# EAGLE design BMS-before routing (EAGLE 6.5.0)
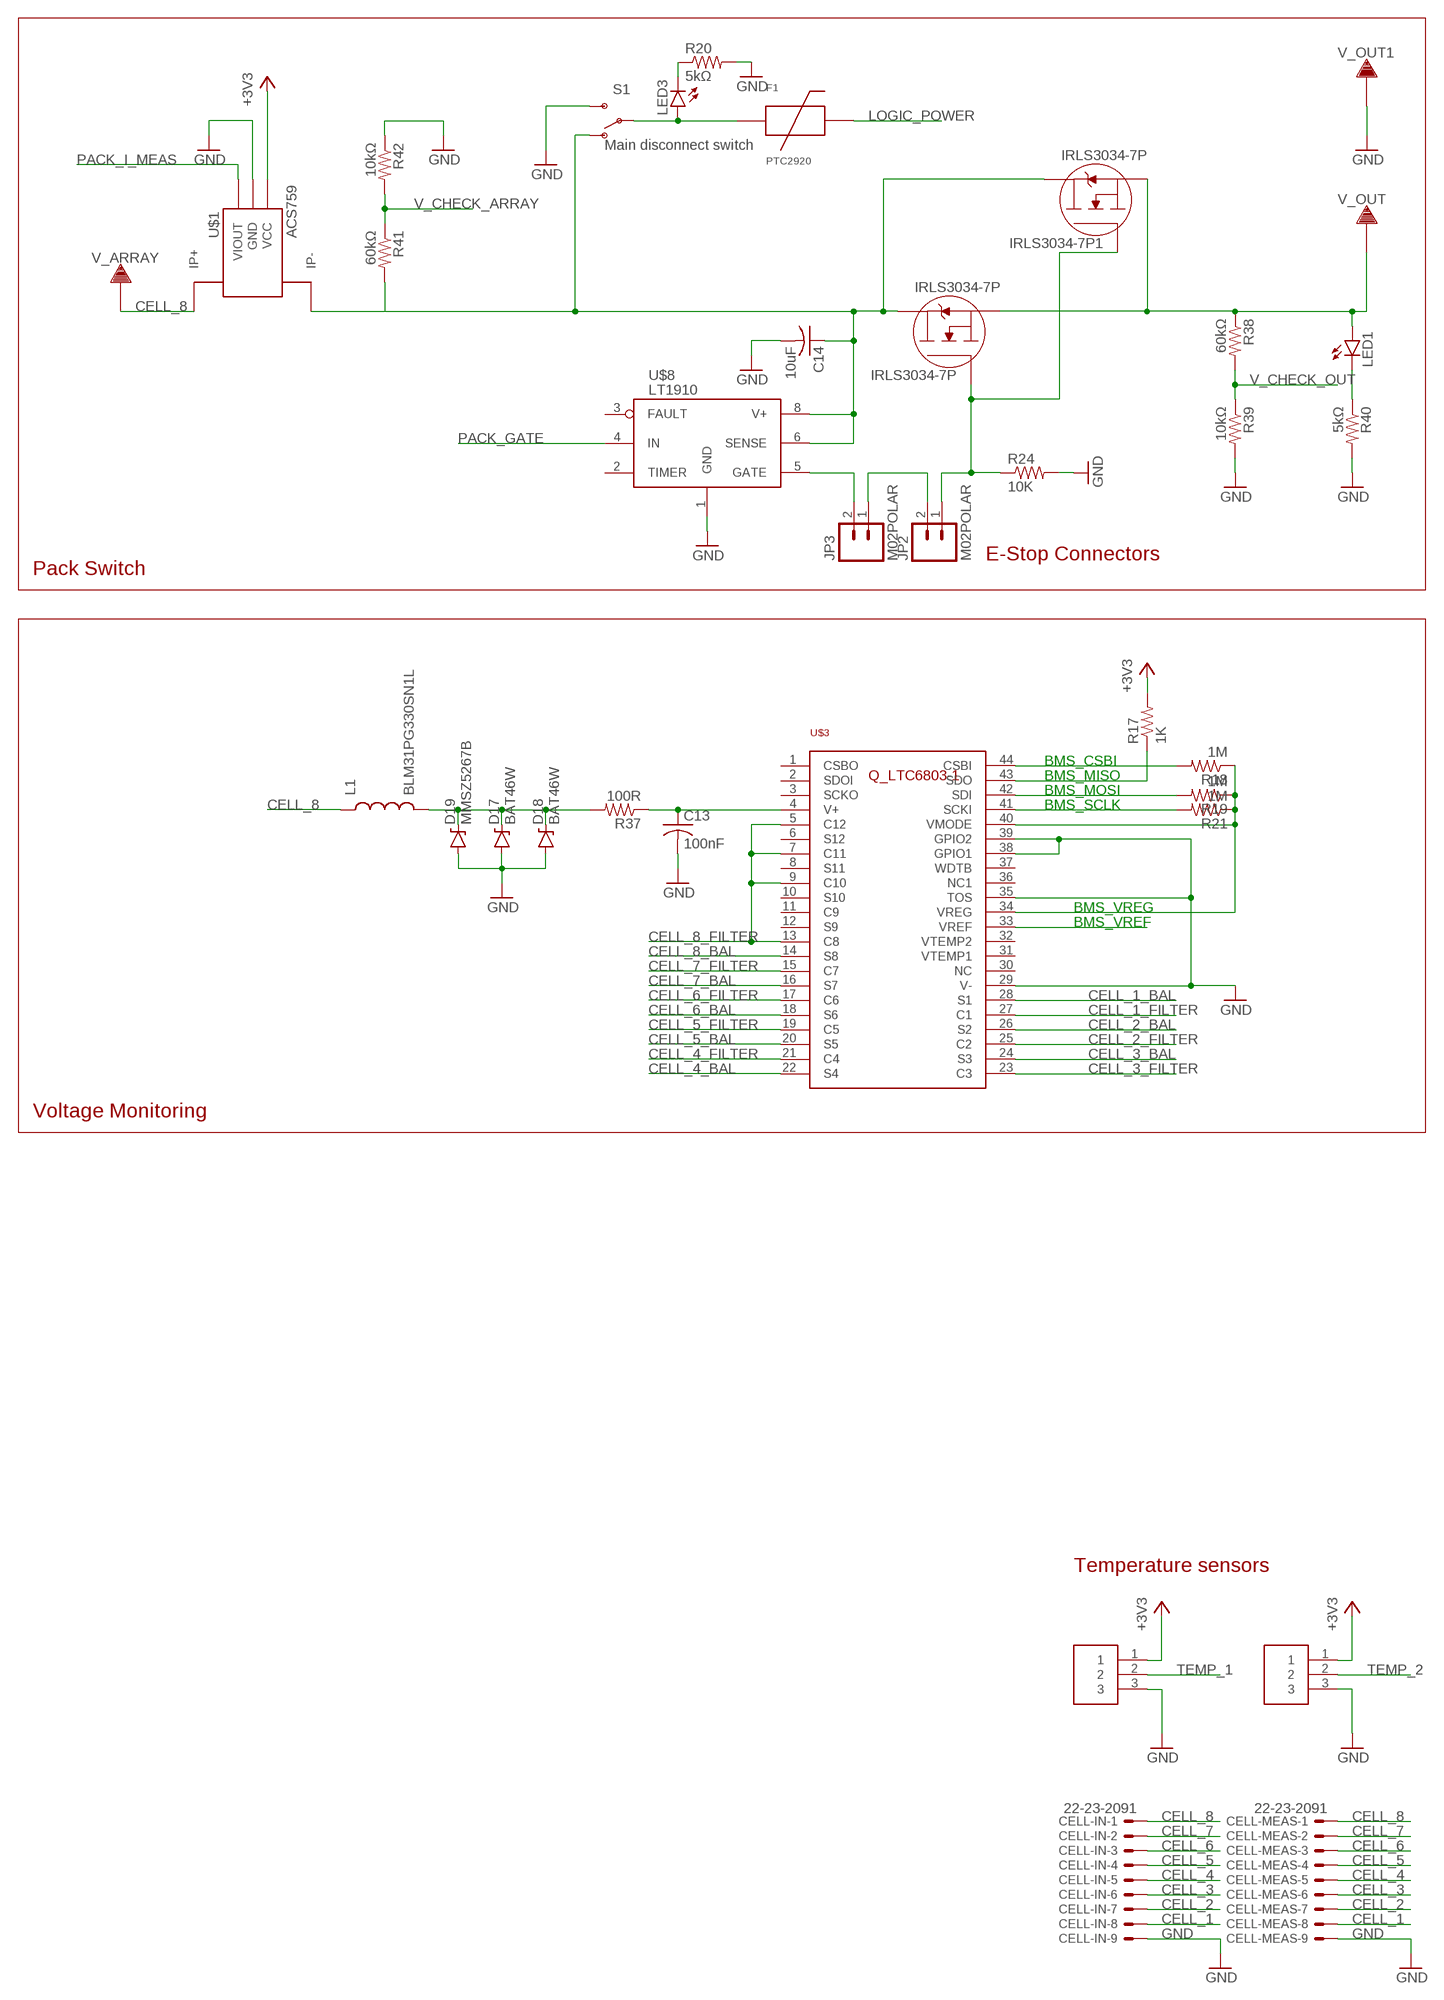
[diagram p0: schematic, sheet 1, part 1 of 2]
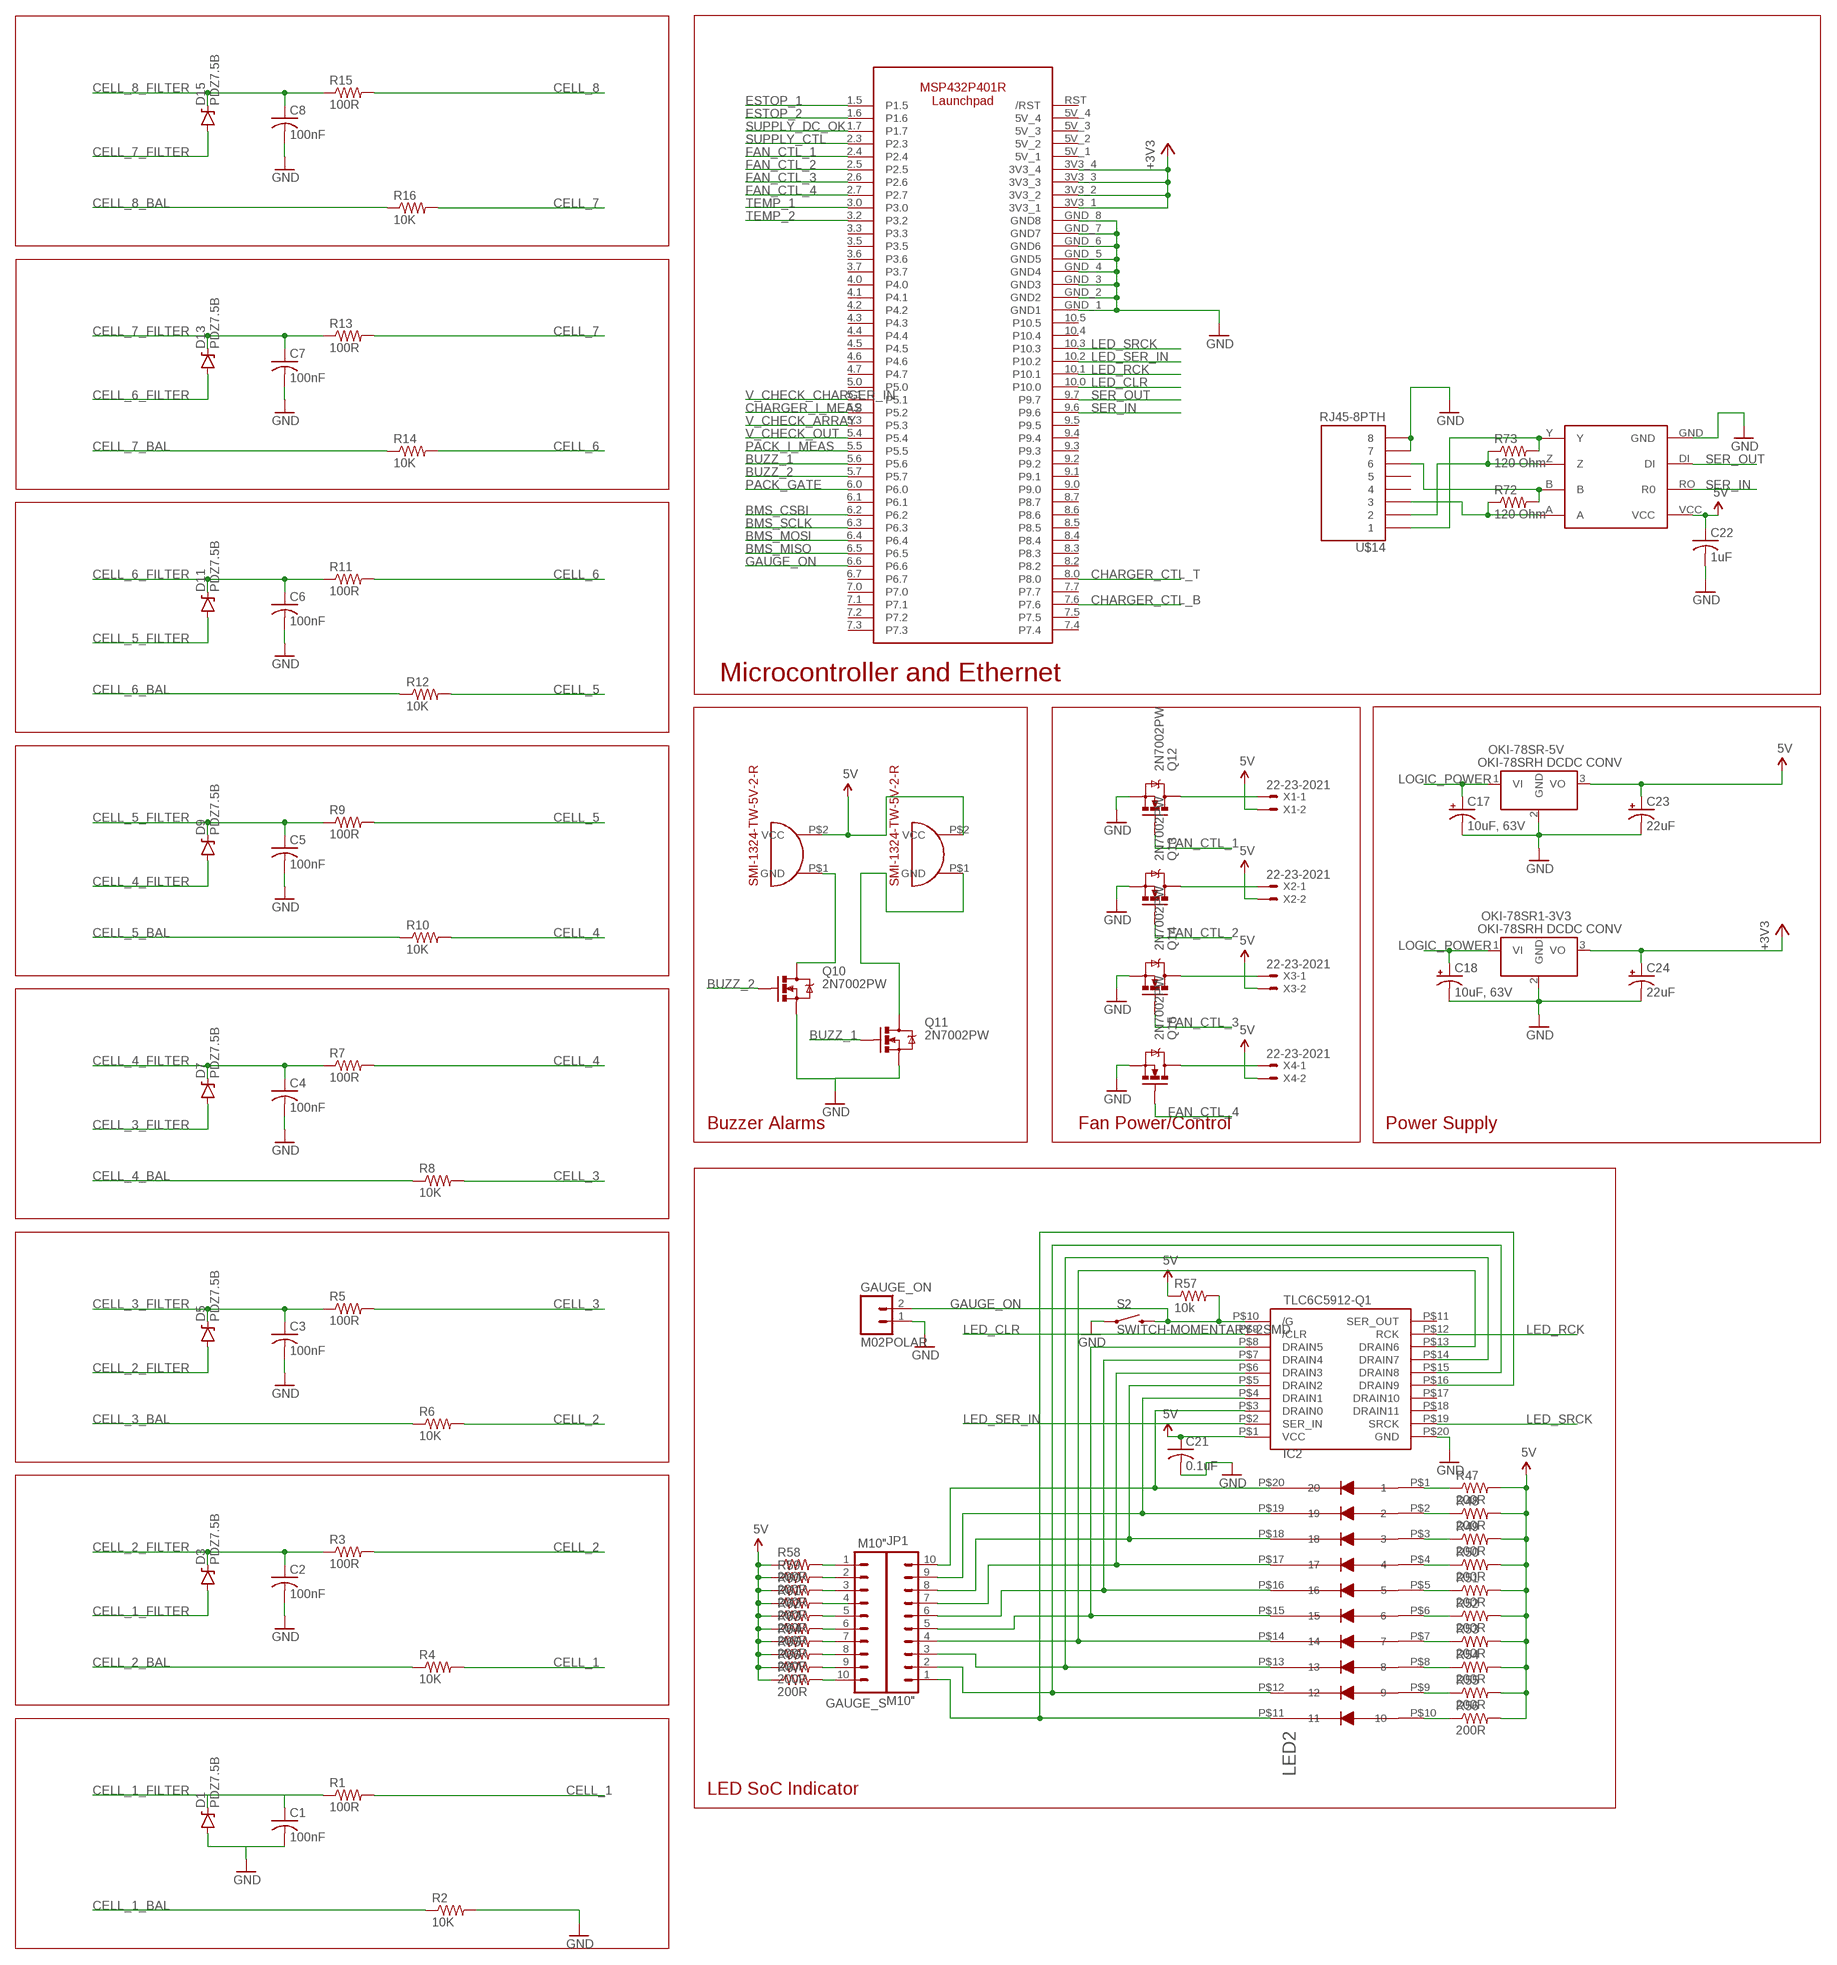
[diagram p1: schematic, sheet 1, part 2 of 2]

## Parts
C1  100nF  C-USC1206  [C1206]
C2  100nF  C-USC1206  [C1206]
C3  100nF  C-USC1206  [C1206]
C4  100nF  C-USC1206  [C1206]
C5  100nF  C-USC1206  [C1206]
C6  100nF  C-USC1206  [C1206]
C7  100nF  C-USC1206  [C1206]
C8  100nF  C-USC1206  [C1206]
C13  100nF  C-USC1206  [C1206]
C14  10uF  C-USC1206  [C1206]
C17  10uF, 63V  CPOL-USD  [PANASONIC_D]
C18  10uF, 63V  CPOL-USD  [PANASONIC_D]
C21  0.1uF  C-USC1206  [C1206]
C22  1uF  C-USC1206  [C1206]
C23  22uF  CPOL-USD  [PANASONIC_D]
C24  22uF  CPOL-USD  [PANASONIC_D]
CELL-IN  22-23-2091  [22-23-2091]
CELL-MEAS  22-23-2091  [22-23-2091]
D1  PDZ7.5B  DIODE-ZENER5.6V  [SOD-323]
D3  PDZ7.5B  DIODE-ZENER5.6V  [SOD-323]
D5  PDZ7.5B  DIODE-ZENER5.6V  [SOD-323]
D7  PDZ7.5B  DIODE-ZENER5.6V  [SOD-323]
D9  PDZ7.5B  DIODE-ZENER5.6V  [SOD-323]
D11  PDZ7.5B  DIODE-ZENER5.6V  [SOD-323]
D13  PDZ7.5B  DIODE-ZENER5.6V  [SOD-323]
D15  PDZ7.5B  DIODE-ZENER5.6V  [SOD-323]
D17  BAT46W  DIODE-ZENER16V  [SOD-123]
D18  BAT46W  DIODE-ZENER16V  [SOD-123]
D19  MMSZ5267B  DIODE-ZENER16V  [SOD-123]
F1  PTC2920  [2920]
GAUGE_ON  M02POLAR  [MOLEX-1X2]
GAUGE_S  M10"  [1X10]
IC2  TLC6C5912-Q1  [SOIC-20]
IRLS3034-7P  IRLS3034-7P  [D2PAK-7]
IRLS3034-7P1  IRLS3034-7P  [D2PAK-7]
J1  SL03THROUGH_HOLE  [MOLEX_SL_03_THROUGH_HOLE]
J2  SL03THROUGH_HOLE  [MOLEX_SL_03_THROUGH_HOLE]
JP1  M10"  [1X10]
JP2  M02POLAR  [MOLEX-1X2]
JP3  M02POLAR  [MOLEX-1X2]
L1  BLM31PG330SN1L  INDUCTOR1210  [1210]
LED1  LED1206  [LED-1206]
LED2  LED-DC7G3HWA  [LED-10]
LED3  LED1206  [LED-1206]
OKI-78SR1-3V3  Q_OKI-78SR12  Q_OKI-78SR  [OKI-78SRH]
OKI-78SR-5V  Q_OKI-78SR5  Q_OKI-78SR  [OKI-78SRH]
Q10  2N7002PW  MOSFET-NCHANNEL2N7002PW  [SOT323]
Q11  2N7002PW  MOSFET-NCHANNEL2N7002PW  [SOT323]
Q12  2N7002PW  MOSFET-NCHANNEL2N7002PW  [SOT323]
Q13  2N7002PW  MOSFET-NCHANNEL2N7002PW  [SOT323]
Q14  2N7002PW  MOSFET-NCHANNEL2N7002PW  [SOT323]
Q15  2N7002PW  MOSFET-NCHANNEL2N7002PW  [SOT323]
R1  100R  R-US_R1206  [R1206]
R2  10K  10KOHM-1/10W-1%(0603)0603  [0603-RES]
R3  100R  R-US_R1206  [R1206]
R4  10K  10KOHM-1/10W-1%(0603)0603  [0603-RES]
R5  100R  R-US_R1206  [R1206]
R6  10K  10KOHM-1/10W-1%(0603)0603  [0603-RES]
R7  100R  R-US_R1206  [R1206]
R8  10K  10KOHM-1/10W-1%(0603)0603  [0603-RES]
R9  100R  R-US_R1206  [R1206]
R10  10K  10KOHM-1/10W-1%(0603)0603  [0603-RES]
R11  100R  R-US_R1206  [R1206]
R12  10K  10KOHM-1/10W-1%(0603)0603  [0603-RES]
R13  100R  R-US_R1206  [R1206]
R14  10K  10KOHM-1/10W-1%(0603)0603  [0603-RES]
R15  100R  R-US_R1206  [R1206]
R16  10K  10KOHM-1/10W-1%(0603)0603  [0603-RES]
R17  1K  1KOHM-1/10W-1%(0603)  [0603-RES]
R18  1M  R-US_R1206  [R1206]
R19  1M  R-US_R1206  [R1206]
R20  5kΩ  R-US_R1206  [R1206]
R21  1M  R-US_R1206  [R1206]
R24  10K  10KOHM-1/10W-1%(0603)0603  [0603-RES]
R37  100R  R-US_R1206  [R1206]
R38  60kΩ  R-US_R1206  [R1206]
R39  10kΩ  R-US_R1206  [R1206]
R40  5kΩ  R-US_R1206  [R1206]
R41  60kΩ  R-US_R1206  [R1206]
R42  10kΩ  R-US_R1206  [R1206]
R47  200R  R-US_R1206  [R1206]
R48  200R  R-US_R1206  [R1206]
R49  200R  R-US_R1206  [R1206]
R50  200R  R-US_R1206  [R1206]
R51  200R  R-US_R1206  [R1206]
R52  200R  R-US_R1206  [R1206]
R53  200R  R-US_R1206  [R1206]
R54  200R  R-US_R1206  [R1206]
R55  200R  R-US_R1206  [R1206]
R56  200R  R-US_R1206  [R1206]
R57  10k  R-US_R1206  [R1206]
R58  200R  R-US_R1206  [R1206]
R59  200R  R-US_R1206  [R1206]
R60  200R  R-US_R1206  [R1206]
R61  200R  R-US_R1206  [R1206]
R62  200R  R-US_R1206  [R1206]
R63  200R  R-US_R1206  [R1206]
R64  200R  R-US_R1206  [R1206]
R65  200R  R-US_R1206  [R1206]
R66  200R  R-US_R1206  [R1206]
R67  200R  R-US_R1206  [R1206]
R72  120 Ohm  RESISTOR1206  [1206]
R73  120 Ohm  RESISTOR1206  [1206]
S1  SWITCH-SPDTPTH  [SWITCH-SPDT]
S2  SWITCH-MOMENTARY-2SMD  [TACTILE-SWITCH-SMD]
U$1  ACS759  [PFF_LEADFORM]
U$2  SMI-1324-TW-5V-2-R  [SMI-1324-TW-5V-2-R]
U$3  Q_LTC6803-1  [SSOP44]
U$4  SMI-1324-TW-5V-2-R  [SMI-1324-TW-5V-2-R]
U$8  LT1910  [SO8]
U$13  MSP432P401R-LAUNCHPAD  [MSP432P401R-LAUNCHPAD]
U$14  RJ45-8PTH  [RJ45-8]
U$15  MAX3077  [MAX3070E]
V_ARRAY  TERMINAL_HOLE  [LARGE_TERMINAL_HOLE]
V_OUT  TERMINAL_HOLE  [LARGE_TERMINAL_HOLE]
V_OUT1  TERMINAL_HOLE  [LARGE_TERMINAL_HOLE]
X1  22-23-2021  [22-23-2021]
X2  22-23-2021  [22-23-2021]
X3  22-23-2021  [22-23-2021]
X4  22-23-2021  [22-23-2021]

## Nets
5V: C21.1 C22.1 C23.+ IC2.P$1(VCC) OKI-78SR-5V.3(VO) R47.2 R48.2 R49.2 R50.2 R51.2 R52.2 R53.2 R54.2 R55.2 R56.2 R57.1 R58.1 R59.1 R60.1 R61.1 R62.1 R63.1 R64.1 R65.1 R66.1 R67.1 U$2.P$2(VCC) U$4.P$2(VCC) U$15.VCC X1.2 X2.2 X3.2 X4.2
+3V3: C24.+ J1.1 J2.1 OKI-78SR1-3V3.3(VO) R17.2 U$1.1(VCC) U$13.3V3_1 U$13.3V3_2 U$13.3V3_3 U$13.3V3_4
BMS_CSBI: R18.2 U$3.44(CSBI) U$13.6.2
BMS_MISO: R17.1 U$3.43(SDO) U$13.6.5
BMS_MOSI: R19.2 U$3.42(SDI) U$13.6.4
BMS_SCLK: R21.2 U$3.41(SCKI) U$13.6.3
BMS_VREF: U$3.33(VREF)
BMS_VREG: R18.1 R19.1 R21.1 U$3.34(VREG) U$3.40(VMODE)
BUZZ_1: Q11.1(G) U$13.5.6
BUZZ_2: Q10.1(G) U$13.5.7
CELL_1: CELL-IN.8 CELL-MEAS.8 R1.2 R4.2
CELL_1_BAL: R2.1 U$3.28(S1)
CELL_1_FILTER: C1.1 D1.C D3.A R1.1 U$3.27(C1)
CELL_2: CELL-IN.7 CELL-MEAS.7 R3.2 R6.2
CELL_2_BAL: R4.1 U$3.26(S2)
CELL_2_FILTER: C2.1 D3.C D5.A R3.1 U$3.25(C2)
CELL_3: CELL-IN.6 CELL-MEAS.6 R5.2 R8.2
CELL_3_BAL: R6.1 U$3.24(S3)
CELL_3_FILTER: C3.1 D5.C D7.A R5.1 U$3.23(C3)
CELL_4: CELL-IN.5 CELL-MEAS.5 R7.2 R10.2
CELL_4_BAL: R8.1 U$3.22(S4)
CELL_4_FILTER: C4.1 D7.C D9.A R7.1 U$3.21(C4)
CELL_5: CELL-IN.4 CELL-MEAS.4 R9.2 R12.2
CELL_5_BAL: R10.1 U$3.20(S5)
CELL_5_FILTER: C5.1 D9.C D11.A R9.1 U$3.19(C5)
CELL_6: CELL-IN.3 CELL-MEAS.3 R11.2 R14.2
CELL_6_BAL: R12.1 U$3.18(S6)
CELL_6_FILTER: C6.1 D11.C D13.A R11.1 U$3.17(C6)
CELL_7: CELL-IN.2 CELL-MEAS.2 R13.2 R16.2
CELL_7_BAL: R14.1 U$3.16(S7)
CELL_7_FILTER: C7.1 D13.C D15.A R13.1 U$3.15(C7)
CELL_8: CELL-IN.1 CELL-MEAS.1 L1.1 R15.2 U$1.4_1(IP+) U$1.4_2(IP+) U$1.4_3(IP+) U$1.4_4(IP+) U$1.4_5(IP+) U$1.4_6(IP+) U$1.4_7(IP+) U$1.4_8(IP+) U$1.4_9(IP+) U$1.4_10(IP+) U$1.4_11(IP+) U$1.4_12(IP+) U$1.4_13(IP+) U$1.4_14(IP+) U$1.4_15(IP+) U$1.4_16(IP+) U$1.4_B(IP+) V_ARRAY.P$1
CELL_8_BAL: R16.1 U$3.14(S8)
CELL_8_FILTER: C8.1 D15.C R15.1 U$3.5(C12) U$3.7(C11) U$3.9(C10) U$3.13(C8)
CHARGER_CTL_B: U$13.7.6
CHARGER_CTL_T: U$13.8.0
CHARGER_I_MEAS: U$13.5.2
ESTOP_1: U$13.1.5
ESTOP_2: U$13.1.6
FAN_CTL_1: Q12.1(G) U$13.2.4
FAN_CTL_2: Q13.1(G) U$13.2.5
FAN_CTL_3: Q14.1(G) U$13.2.6
FAN_CTL_4: Q15.1(G) U$13.2.7
GAUGE_D: IC2.P$6(DRAIN3) JP1.7 LED2.P$17
GAUGE_ON: GAUGE_ON.2 IC2.P$10(/G) R57.2 S2.3 U$13.6.6
GND: C1.2 C2.2 C3.2 C4.2 C5.2 C6.2 C7.2 C8.2 C13.2 C14.2 C17.- C18.- C21.2 C22.2 C23.- C24.- CELL-IN.9 CELL-MEAS.9 D1.A D17.A D18.A D19.A GAUGE_ON.1 IC2.P$20(GND) J1.3 J2.3 OKI-78SR1-3V3.2(GND) OKI-78SR-5V.2(GND) Q10.2(S) Q11.2(S) Q12.2(S) Q13.2(S) Q14.2(S) Q15.2(S) R2.2 R20.2 R24.2 R39.2 R40.2 R42.1 S1.3(S) S2.1 U$1.2(GND) U$3.29(V-) U$3.35(TOS) U$3.38(GPIO1) U$3.39(GPIO2) U$8.1(GND) U$13.GND_1(GND1) U$13.GND_2(GND2) U$13.GND_3(GND3) U$13.GND_4(GND4) U$13.GND_5(GND5) U$13.GND_6(GND6) U$13.GND_7(GND7) U$13.GND_8(GND8) U$14.7 U$14.8 U$15.GND V_OUT1.P$1
LED_CLR: IC2.P$9(/CLR) U$13.10.0
LED_RCK: IC2.P$12(RCK) U$13.10.1
LED_SER_IN: IC2.P$2(SER_IN) U$13.10.2
LED_SRCK: IC2.P$19(SRCK) U$13.10.3
LOGIC_POWER: C17.+ C18.+ F1.P$2 OKI-78SR1-3V3.1(VI) OKI-78SR-5V.1(VI)
N$1: JP3.2 U$8.5(GATE)
N$2: F1.P$1 LED3.A S1.2(P)
N$3: IRLS3034-7P1.2(SOURCE) IRLS3034-7P1.3(SOURCE) IRLS3034-7P1.4(SOURCE) IRLS3034-7P1.5(SOURCE) IRLS3034-7P1.6(SOURCE) IRLS3034-7P.2(SOURCE) IRLS3034-7P.3(SOURCE) IRLS3034-7P.4(SOURCE) IRLS3034-7P.5(SOURCE) IRLS3034-7P.6(SOURCE) LED1.A R38.1 V_OUT.P$1
N$4: LED3.C R20.1
N$6: JP2.2 JP3.1
N$26: D17.C D18.C D19.C L1.2 R37.2
N$31: C13.1 R37.1 U$3.4(V+)
N$32: IC2.P$3(DRAIN0) JP1.10 LED2.P$20
N$34: IRLS3034-7P1.1(GATE) IRLS3034-7P.1(GATE) JP2.1 R24.1
N$35: R73.2 U$14.1 U$15.Y
N$36: LED1.C R40.1
N$41: C14.1 IRLS3034-7P1.PAD(DRAIN) IRLS3034-7P.PAD(DRAIN) R41.2 S1.1(O) U$1.5_1(IP-) U$1.5_2(IP-) U$1.5_3(IP-) U$1.5_4(IP-) U$1.5_5(IP-) U$1.5_6(IP-) U$1.5_7(IP-) U$1.5_8(IP-) U$1.5_9(IP-) U$1.5_10(IP-) U$1.5_11(IP-) U$1.5_12(IP-) U$1.5_13(IP-) U$1.5_14(IP-) U$1.5_15(IP-) U$1.5_16(IP-) U$1.5_B(IP-) U$1.5_T(IP-) U$8.6(SENSE) U$8.8(V+)
N$43: IC2.P$4(DRAIN1) JP1.9 LED2.P$19
N$44: IC2.P$5(DRAIN2) JP1.8 LED2.P$18
N$45: R73.1 U$14.2 U$15.Z
N$46: IC2.P$7(DRAIN4) JP1.6 LED2.P$16
N$47: IC2.P$8(DRAIN5) JP1.5 LED2.P$15
N$48: IC2.P$13(DRAIN6) JP1.4 LED2.P$14
N$49: IC2.P$14(DRAIN7) JP1.3 LED2.P$13
N$50: IC2.P$15(DRAIN8) JP1.2 LED2.P$12
N$51: IC2.P$16(DRAIN9) JP1.1 LED2.P$11
N$52: LED2.P$1 R47.1
N$53: LED2.P$2 R48.1
N$54: LED2.P$3 R49.1
N$55: LED2.P$4 R50.1
N$56: LED2.P$5 R51.1
N$57: LED2.P$6 R52.1
N$58: LED2.P$7 R53.1
N$59: LED2.P$8 R54.1
N$60: LED2.P$9 R55.1
N$61: LED2.P$10 R56.1
N$62: R72.2 U$14.6 U$15.B
N$63: Q11.3(D) U$4.P$1(GND)
N$64: Q10.3(D) U$2.P$1(GND)
N$66: Q12.3(D) X1.1
N$67: R72.1 U$14.3 U$15.A
N$70: Q13.3(D) X2.1
N$71: Q14.3(D) X3.1
N$72: Q15.3(D) X4.1
N$75: GAUGE_S.1 R58.2
N$76: GAUGE_S.2 R59.2
N$77: GAUGE_S.3 R60.2
N$78: GAUGE_S.4 R61.2
N$79: GAUGE_S.5 R62.2
N$80: GAUGE_S.6 R63.2
N$81: GAUGE_S.7 R64.2
N$82: GAUGE_S.8 R65.2
N$83: GAUGE_S.9 R66.2
N$84: GAUGE_S.10 R67.2
PACK_GATE: U$8.4(IN) U$13.6.0
PACK_I_MEAS: U$1.3(VIOUT) U$13.5.5
SER_IN: U$13.9.6 U$15.RO(R0)
SER_OUT: U$13.9.7 U$15.DI
SUPPLY_CTL: U$13.2.3
SUPPLY_DC_OK: U$13.1.7
TEMP_1: J2.2 U$13.3.0
TEMP_2: J1.2 U$13.3.2
V_CHECK_ARRAY: R41.1 R42.2 U$13.5.3
V_CHECK_CHARGER_IN: U$13.5.1
V_CHECK_OUT: R38.2 R39.1 U$13.5.4
Unconnected: IC2.P$11(SER_OUT) IC2.P$17(DRAIN10) IC2.P$18(DRAIN11) U$3.1(CSBO) U$3.2(SDOI) U$3.3(SCKO) U$3.6(S12) U$3.8(S11) U$3.10(S10) U$3.11(C9) U$3.12(S9) U$3.30(NC) U$3.31(VTEMP1) U$3.32(VTEMP2) U$3.36(NC1) U$3.37(WDTB) U$8.2(TIMER) U$8.3(FAULT) U$13.3.3 U$13.3.5 U$13.3.6 U$13.3.7 U$13.4.0 U$13.4.1 U$13.4.2 U$13.4.3 U$13.4.4 U$13.4.5 U$13.4.6 U$13.4.7 U$13.5.0 U$13.5V_1 U$13.5V_2 U$13.5V_3 U$13.5V_4 U$13.6.1 U$13.6.7 U$13.7.0 U$13.7.1 U$13.7.2 U$13.7.3 U$13.7.4 U$13.7.5 U$13.7.7 U$13.8.2 U$13.8.3 U$13.8.4 U$13.8.5 U$13.8.6 U$13.8.7 U$13.9.0 U$13.9.1 U$13.9.2 U$13.9.3 U$13.9.4 U$13.9.5 U$13.10.4 U$13.10.5 U$13.RST(/RST) U$14.4 U$14.5

## Notes on the sheet
- Main disconnect switch
- E-Stop Connectors
- Pack Switch
- BMS_CSBI
- BMS_MISO | Microcontroller and Ethernet
- BMS_MOSI
- BMS_SCLK
- BMS_VREG
- BMS_VREF
- CELL_8_FILTER
- CELL_8_BAL
- CELL_7_FILTER
- CELL_7_BAL
- CELL_6_FILTER | CELL_1_BAL
- CELL_6_BAL | CELL_1_FILTER
- CELL_5_FILTER | CELL_2_BAL
- CELL_5_BAL | CELL_2_FILTER
- CELL_4_FILTER | CELL_3_BAL
- CELL_4_BAL | CELL_3_FILTER
- Voltage Monitoring
- Buzzer Alarms | Fan Power/Control | Power Supply
- Temperature sensors
- CELL_1_FILTER | CELL_1 | LED SoC Indicator
- CELL_1_BAL

## Library data of the parts
C1-C8 C13 C14 = rcl:C-US: CAPACITOR, American symbol
C17 C18 C23 C24 = rcl:CPOL-US: POLARIZED CAPACITOR, American symbol
C21 C22 = resistor:C-US: CAPACITOR, American symbol
CELL-IN CELL-MEAS = con-molex:22-23-2091: .100" (2.54mm) Center Header - 9 Pin; MF: MOLEX; MPN: 22-23-2091; OC_FARNELL: 1756827; OC_NEWARK: 56H0450
D1 D3 D5 D7 D9 D11 D13 D15 = SparkFun-DiscreteSemi:DIODE-ZENER: Zener Diode Production Part - 8199 3.4V Zener Voltage; PROD_ID: DIO-12442; VALUE: 5.6V
D17-D19 = SparkFun-DiscreteSemi:DIODE-ZENER: Zener Diode Production Part - 8199 3.4V Zener Voltage; PROD_ID: DIO-12440; VALUE: 16V
F1 = 2016PowerPackLibraries:PTC2920
GAUGE_ON JP2 JP3 = SparkFun-Connectors:M02: Standard 2-pin 0.1" header. Use with - straight break away headers ( PRT-00116) - right angle break away headers (PRT-00553) - swiss pins (PRT-00743) - machine pins (PRT-00117) - female headers (PRT-00115) Molex polarized connector foot print use with: PRT-08233 with associated crimp pins and housings. 2.54_SCREWTERM for use with PRT-10571. 3.5mm Screw Terminal footprints for PRT-08084 5mm Screw Terminal footprints for use with PRT-08433
GAUGE_S JP1 = SparkFun-Connectors:M10: Header 10 Standard 10-pin 0.1" header. Use with straight break away headers (SKU : PRT-00116), right angle break away headers (PRT-00553), swiss pins (PRT-00743), machine pins (PRT-00117), and female headers (PRT-00115).
IC2 = 2016PowerPackLibraries:TLC6C5912-Q1
IRLS3034-7P IRLS3034-7P1 = MRDT-2015-BMS:IRLS3034-7P: High-current SMD MOSFET
J1 J2 = MRDT-Connectors:SL03: Molex 3-pin SL connector Locking 3 pin connector with standard header spacing. Backward compatible with standard RC servo connectors.; ORIENT: HORIZ; PARTNO: 0705550002
L1 = SparkFun-Passives:INDUCTOR: Inductors Basic Inductor/Choke - 0603 and 1206. Footprints are not proven and vary greatly between part numbers. INDUCTOR POWER 3.3UH 4.0A SMD 0.197" L x 0.197" W x 0.177" H (5.00mm x 5.00mm x 4.50mm)
LED1 LED3 = SparkFun-LED:LED: LEDs Standard schematic elements and footprints for 5mm, 3mm, 1206, and 0603 sized LEDs. 5mm - Spark Fun Electronics SKU : COM-00529 (and others)
LED2 = 2016PowerPackLibraries:LED-DC7G3HWA: 10 segement LED - Kingbright part # DC7G3HWA
OKI-78SR1-3V3 OKI-78SR-5V = MRDT-2015-PowerBoard:Q_OKI-78SR: 4.95W DC/DC Converter Manufacturer: Murata Part Number: OKI-78SR-5/1.5-W36H-C OKI-78SR-3.3/1.5-W36H-C
Q10-Q15 = SparkFun-DiscreteSemi:MOSFET-NCHANNEL: Common NMOSFET Parts MFG P/N Store ID Prod ID FDD8780 TRANS-09984 SI7820DN TRANS-11055 FDS6630A IC-08089 2N7002PW TRANS-11151 FQP30N06L COM-10213 TRANS-10060 BSS123LT1G TRANS-08345 BSS138 TRANS-00830 BS170 2N7000; PROD_ID: TRANS-11151
R1 R3 R5 R7 R9 R11 R13 R15 R18 R19 R21 R37 R47-R67 = rcl:R-US_: RESISTOR, American symbol
R2 R4 R6 R8 R10 R12 R14 R16 R24 = SparkFun-Resistors:10KOHM-1/10W-1%(0603): RES-00824; PROD_ID: RES-00824
R17 = SparkFun-Resistors:1KOHM-1/10W-1%(0603): RES-07856; PROD_ID: RES-07856
R20 R38-R42 = resistor:R-US_: RESISTOR, American symbol
R72 R73 = SparkFun-Passives:RESISTOR: Resistor Basic schematic elements and footprints for 0603, 1206, and PTH resistors.
S1 = SparkFun-Electromechanical:SWITCH-SPDT: SPDT Switch Simple slide switch, Spark Fun Electronics SKU : COM-00102 DPDT SMT slide switch, AYZ0202, SWCH-08179
S2 = SparkFun-Electromechanical:SWITCH-MOMENTARY-2: Various NO switches- pushbuttons, reed, etc; PROD_ID: SWCH-08247
U$1 = MRDT-2017-BMS:ACS759
U$2 U$4 = MRDT-2017-BMS:SMI-1324-TW-5V-2-R
U$3 = MRDT-2017-BMS:Q_LTC6803-1
U$8 = MRDT-2015-PowerBoard:LT1910
U$13 = 2016PowerPackLibraries:MSP432P401R-LAUNCHPAD
U$14 = SparkFun-Connectors:RJ45-8: RJ45 Jack Simple RJ45, 8-pin connection - connector for common Cat5, Cat5e, and Cat6 Ethernet cables. Footprint not yet proven in production. Connector sku is PRT-00643; Breakout PCB sku is BOB-00716.
U$15 = MAX3077:MAX3077
V_ARRAY V_OUT V_OUT1 = MRDT-2015-PowerBoard:TERMINAL_HOLE
X1-X4 = con-molex:22-23-2021: .100" (2.54mm) Center Header - 2 Pin; MF: MOLEX; MPN: 22-23-2021; OC_FARNELL: 1462926; OC_NEWARK: 25C3832

## Net classes
0 default: clearance 0.205 mm

## Board
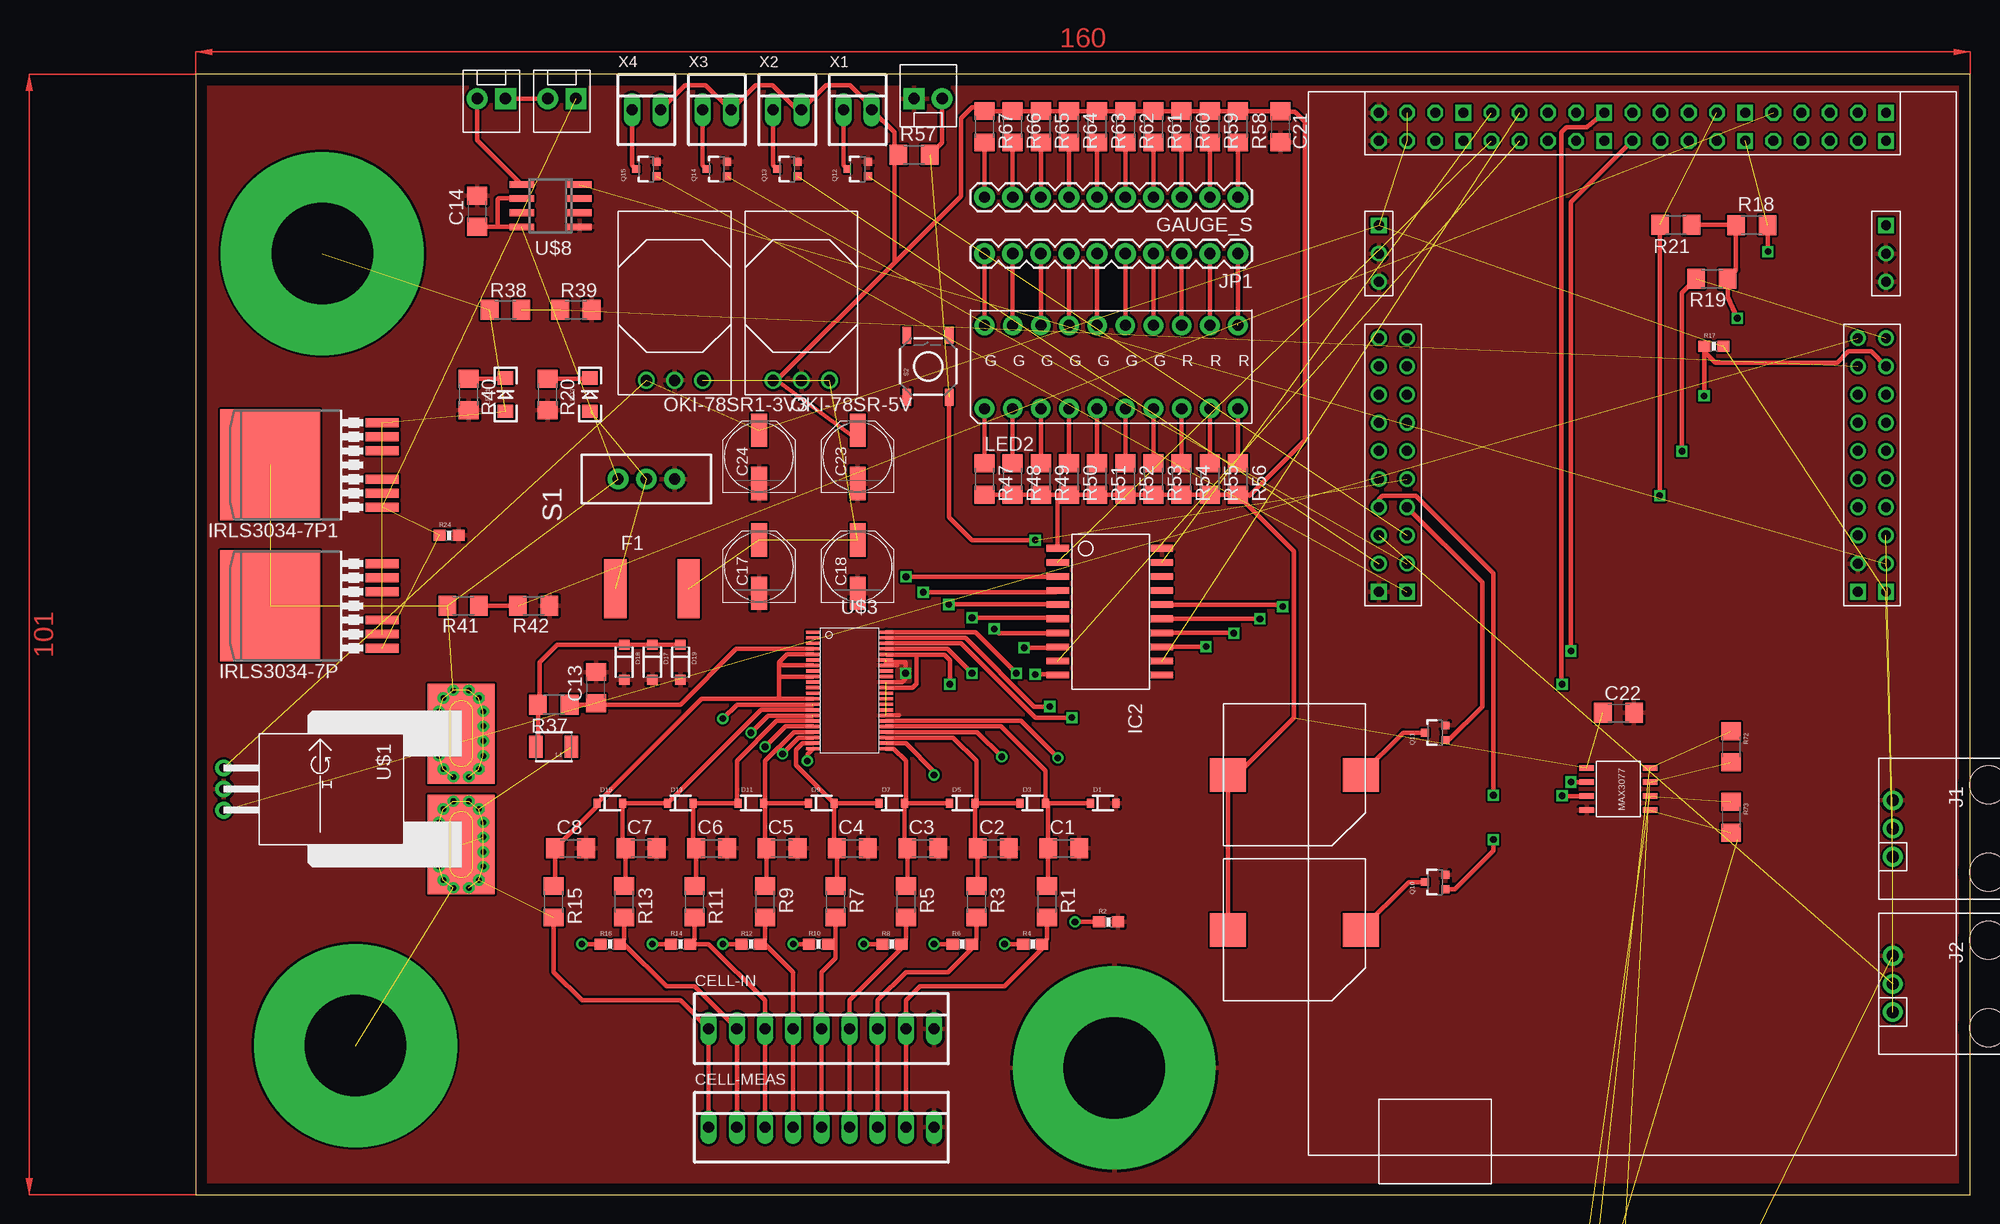
[diagram p2: board, top side]
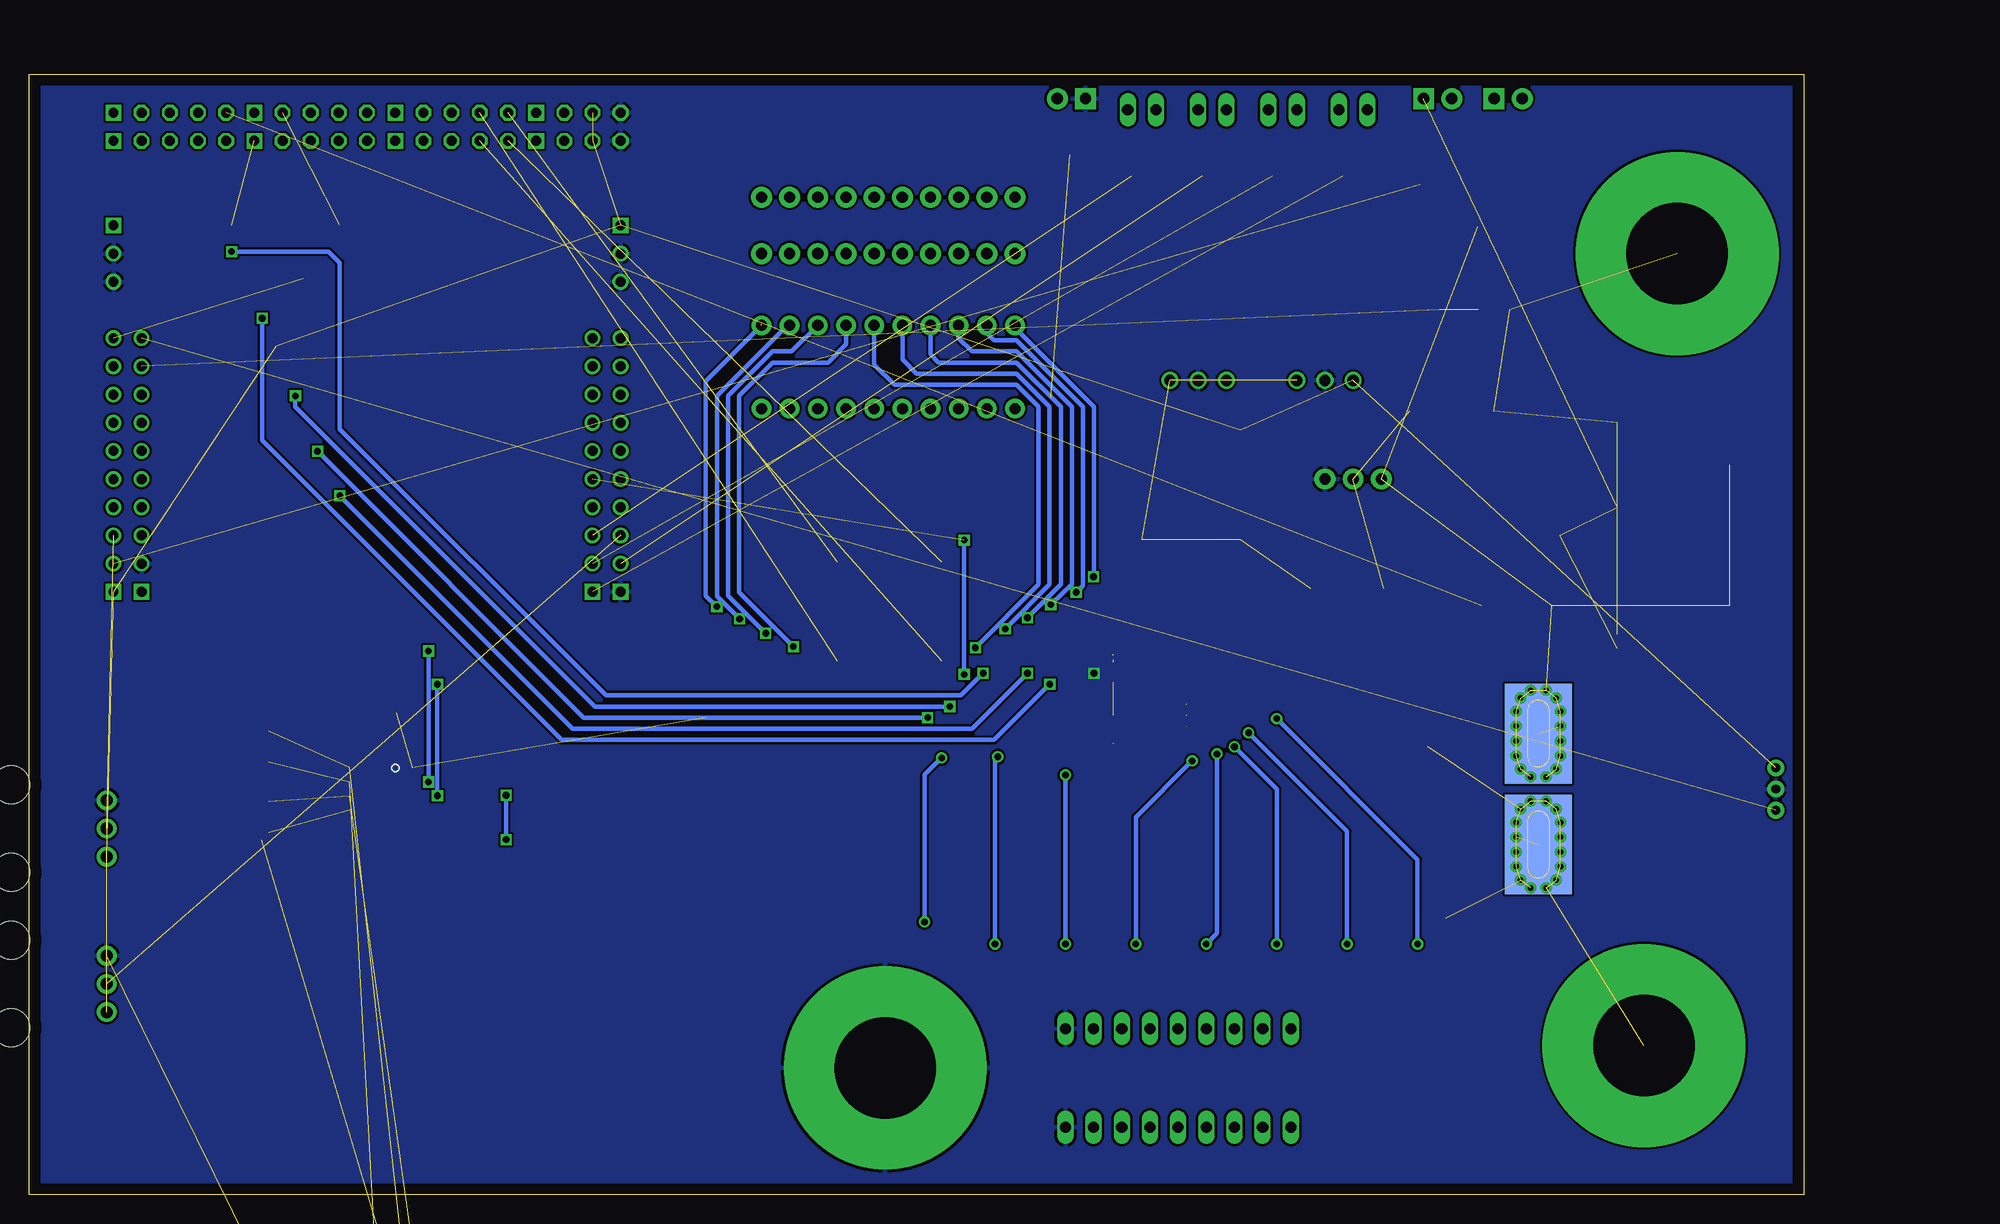
[diagram p3: board, bottom side, seen from below]

Size 160 x 101 mm. Coordinates in mm from the lower left corner, seen from the top.
Outline: 0,0 160,0 160,101 0,101 0,0
Copper layers (1*16): Top 0.035mm / dielectric 1.5mm / Bottom 0.035mm
Design rules "default": minimum track width 10mil, minimum drill 24mil, track to track 8mil, track to pad 8mil, pad to pad 8mil, via to via 8mil, smd to smd 8mil, copper to edge 40mil, drill to drill 8mil, minimum pad ring 10mil, minimum via ring 8mil, stop-mask expansion 4mil, vias tented up to drill 0mil, thermal gap 10mil

### Footprints (pad centres in the part's own frame; a part is rotated, then mirrored left to right if it is on the bottom)
C1206 = smd 1.6 x 1.8: 1 -1.4,0; 2 1.4,0
PANASONIC_D = smd 3 x 1.4: + 2.4,0; - -2.4,0
22-23-2091 = drill 1 long: 1 -10.16,0; 2 -7.62,0; 3 -5.08,0; 4 -2.54,0; 5 0,0; 6 2.54,0; 7 5.08,0; 8 7.62,0; 9 10.16,0
SOD-323 = smd 0.63 x 0.83: A 1.15,0; C -1.15,0
SOD-123 = smd 0.9 x 0.95: A 1.575,0; C -1.575,0
2920 = smd 2 x 5.3: P$1 0,0; P$2 6.6,0
MOLEX-1X2 = drill 1.016 pad 1.88 square: 1 0,0 | drill 1.016 pad 1.88: 2 2.54,0
1X10 = drill 1.016 pad 1.88: 1 0,0; 2 2.54,0; 3 5.08,0; 4 7.62,0; 5 10.16,0; 6 12.7,0; 7 15.24,0; 8 17.78,0; 9 20.32,0; 10 22.86,0
SOIC-20 = smd 0.6 x 2: P$1 0,0; P$2 1.27,0; P$3 2.54,0; P$4 3.81,0; P$5 5.08,0; P$6 6.35,0; P$7 7.62,0; P$8 8.89,0; P$9 10.16,0; P$10 11.43,0; P$11 11.43,9.4; P$12 10.16,9.4; P$13 8.89,9.4; P$14 7.62,9.4; P$15 6.35,9.4; P$16 5.08,9.4; P$17 3.81,9.4; P$18 2.54,9.4; P$19 1.27,9.4; P$20 0,9.4
D2PAK-7 = smd 0.8 x 3: 1 -3.81,-9.207; 2 -2.54,-9.207; 3 -1.27,-9.207; 4 1.27,-9.207; 5 2.54,-9.207; 6 3.81,-9.207 | smd 10 x 9: PAD 0,0.895
MOLEX_SL_03_THROUGH_HOLE = drill 1.092 pad 1.778: 1 2.54,0; 2 0,0; 3 -2.54,0 | hole 3.404: -3.937,8.636; 3.937,8.636
1210 = smd 1.2 x 2: 1 -1.6,0; 2 1.6,0
LED-1206 = smd 1.2 x 1.4: A -1.5,0; C 1.5,0
LED-10 = drill 1 pad 1.778: P$1 0,0; P$2 2.54,0; P$3 5.08,0; P$4 7.62,0; P$5 10.16,0; P$6 12.7,0; P$7 15.24,0; P$8 17.78,0; P$9 20.32,0; P$10 22.86,0; P$11 22.86,7.5; P$12 20.32,7.5; P$13 17.78,7.5; P$14 15.24,7.5; P$15 12.7,7.5; P$16 10.16,7.5; P$17 7.62,7.5; P$18 5.08,7.5; P$19 2.54,7.5; P$20 0,7.5
OKI-78SRH = drill 1.016: 1 2.54,0; 2 0,0; 3 -2.54,0
SOT323 = smd 0.7 x 0.7: 1 -0.65,-0.925; 2 0.65,-0.925; 3 0,0.925
R1206 = smd 1.6 x 1.803: 1 -1.422,0; 2 1.422,0
0603-RES = smd 1.1 x 1: 1 -0.85,0; 2 0.85,0
1206 = smd 1.6 x 1.8: 1 -1.4,0; 2 1.4,0
SWITCH-SPDT = drill 1.016 pad 1.88: 1 0,2.54; 2 0,0; 3 0,-2.54
TACTILE-SWITCH-SMD = smd 1.524 x 0.762: 1 -2.794,1.905; 2 2.794,1.905; 3 -2.794,-1.905; 4 2.794,-1.905
PFF_LEADFORM = drill 0.8 pad 1.5: 1 -1.91,-10.16; 2 0,-10.16; 3 1.91,-10.16 | drill 0.5: 4_1 3,13.24; 4_2 4.33,13.24; 4_3 5.67,13.24; 4_4 7,13.24; 4_5 8.2,12.84; 4_6 8.9,11.94; 4_7 8.9,10.54; 4_8 8.2,9.64; 4_9 7,9.24; 4_10 5.67,9.24; 4_11 4.33,9.24; 4_12 3,9.24; 4_13 1.8,9.64; 4_14 1.1,10.54; 4_15 1.1,11.94; 4_16 1.8,12.84; 5_1 -7,13.24; 5_2 -5.67,13.24; 5_3 -4.33,13.24; 5_4 -3,13.24; 5_5 -1.8,12.84; 5_6 -1.1,11.94; 5_7 -1.1,10.54; 5_8 -1.8,9.64; 5_9 -3,9.24; 5_10 -4.33,9.24; 5_11 -5.67,9.24; 5_12 -7,9.24; 5_13 -8.2,9.64; 5_14 -8.9,10.54; 5_15 -8.9,11.94; 5_16 -8.2,12.84 | smd 9 x 6 bottom: 4_B 5,11.24; 5_B -5,11.24 | smd 9 x 6: 4_T 5,11.24; 5_T -5,11.24
SMI-1324-TW-5V-2-R = smd 3.25 x 3: P$1 6,0; P$2 -6,0
SSOP44 = smd 0.3 x 1.25: 1 -5.25,-3.3; 2 -4.75,-3.3; 3 -4.25,-3.3; 4 -3.75,-3.3; 5 -3.25,-3.3; 6 -2.75,-3.3; 7 -2.25,-3.3; 8 -1.75,-3.3; 9 -1.25,-3.3; 10 -0.75,-3.3; 11 -0.25,-3.3; 12 0.25,-3.3; 13 0.75,-3.3; 14 1.25,-3.3; 15 1.75,-3.3; 16 2.25,-3.3; 17 2.75,-3.3; 18 3.25,-3.3; 19 3.75,-3.3; 20 4.25,-3.3; 21 4.75,-3.3; 22 5.25,-3.3; 23 5.25,3.3; 24 4.75,3.3; 25 4.25,3.3; 26 3.75,3.3; 27 3.25,3.3; 28 2.75,3.3; 29 2.25,3.3; 30 1.75,3.3; 31 1.25,3.3; 32 0.75,3.3; 33 0.25,3.3; 34 -0.25,3.3; 35 -0.75,3.3; 36 -1.25,3.3; 37 -1.75,3.3; 38 -2.25,3.3; 39 -2.75,3.3; 40 -3.25,3.3; 41 -3.75,3.3; 42 -4.25,3.3; 43 -4.75,3.3; 44 -5.25,3.3
SO8 = smd 0.6 x 2.2: 1 -1.905,-2.6; 2 -0.635,-2.6; 3 0.635,-2.6; 4 1.905,-2.6; 5 1.905,2.6; 6 0.635,2.6; 7 -0.635,2.6; 8 -1.905,2.6
MSP432P401R-LAUNCHPAD = drill 0.9: 1.5 7.62,30.48; 1.6 53.34,33.02; 1.7 53.34,30.48; 2.3 50.8,30.48; 2.4 50.8,40.64; 2.5 53.34,43.18; 2.6 50.8,43.18; 3.0 53.34,40.64; 3.2 7.62,40.64; 3.3 7.62,38.1; 3.5 50.8,25.4; 3.6 53.34,22.86; 3.7 50.8,22.86; 4.0 10.16,38.1; 4.1 7.62,35.56; 4.2 10.16,35.56; 4.3 7.62,33.02; 4.4 10.16,33.02; 4.5 10.16,30.48; 4.6 7.62,27.94; 4.7 10.16,27.94; 5.0 53.34,27.94; 5.1 50.8,27.94; 5.2 53.34,25.4; 5.4 10.16,25.4; 5.5 10.16,22.86; 5.6 50.8,38.1; 5.7 53.34,38.1; 6.0 7.62,43.18; 6.1 10.16,40.64; 6.4 7.62,22.86; 6.5 7.62,25.4; 6.6 50.8,35.56; 6.7 50.8,33.02; GND_1 10.16,43.18; GND_3 7.62,17.78; GND_4 53.34,17.78; GND_5 7.62,15.24; GND_6 53.34,15.24; RST 53.34,35.56 | drill 0.9 square: 2.7 50.8,45.72; 3V3_1 7.62,45.72; 3V3_2 53.34,12.7; 5V_1 10.16,45.72; 5V_2 7.62,12.7; 6.2 20.32,5.08; 8.0 33.02,5.08; 8.5 7.62,5.08; 8.6 7.62,2.54; 9.3 20.32,2.54; 9.7 33.02,2.54; 10.4 45.72,5.08; 10.5 45.72,2.54; GND_2 53.34,45.72 | drill 0.9 octagon: 3V3_3 50.8,5.08; 3V3_4 50.8,2.54; 5.3 17.78,2.54; 5V_3 48.26,5.08; 5V_4 48.26,2.54; 6.3 22.86,2.54; 7.0 27.94,2.54; 7.1 25.4,5.08; 7.2 25.4,2.54; 7.3 22.86,5.08; 7.4 35.56,5.08; 7.5 35.56,2.54; 7.6 38.1,5.08; 7.7 38.1,2.54; 8.2 15.24,5.08; 8.3 15.24,2.54; 8.4 12.7,5.08; 8.7 10.16,2.54; 9.0 10.16,5.08; 9.1 12.7,2.54; 9.2 17.78,5.08; 9.4 27.94,5.08; 9.5 30.48,2.54; 9.6 30.48,5.08; 10.0 40.64,5.08; 10.1 40.64,2.54; 10.2 43.18,5.08; 10.3 43.18,2.54; GND_7 53.34,5.08; GND_8 53.34,2.54
RJ45-8 = drill 1 pad 1.88 square: 1 -4.445,6.35 | drill 1 pad 1.88: 2 -3.175,8.89; 3 -1.905,6.35; 4 -0.635,8.89; 5 0.635,6.35; 6 1.905,8.89; 7 3.175,6.35; 8 4.445,8.89 | hole 3.2: -5.715,0; 5.715,0
MAX3070E = smd 0.49 x 1.3: A -1.905,2.857; B -0.635,2.857; DI 0.635,-2.857; GND 1.905,-2.857; RO -0.635,-2.857; VCC -1.905,-2.857; Y 1.905,2.857; Z 0.635,2.857
LARGE_TERMINAL_HOLE = drill 9.144 pad 18.288: P$1 0,0
22-23-2021 = drill 1 long: 1 -1.27,0; 2 1.27,0

### Placement (x,y rotation side)
C1  78.26,31.23 0 top
C2  71.91,31.23 0 top
C3  65.56,31.23 0 top
C4  59.21,31.23 0 top
C5  52.86,31.23 0 top
C6  46.51,31.23 0 top
C7  40.16,31.23 0 top
C8  33.81,31.23 0 top
C13  36.1,45.7 90 top
C14  25.4,88.63 90 top
C17  50.8,56.61 90 top
C18  59.69,56.61 90 top
C21  97.79,96.25 270 top
C22  128.28,43.43 0 top
C23  59.69,66.5 90 top
C24  50.8,66.5 90 top
CELL-IN  56.42,14.97 0 top
CELL-MEAS  56.42,6.08 0 top
D1  81.82,35.29 0 top
D3  75.47,35.29 0 top
D5  69.12,35.29 0 top
D7  62.77,35.29 0 top
D9  56.42,35.29 0 top
D11  50.07,35.29 0 top
D13  43.72,35.29 0 top
D15  37.37,35.29 0 top
D17  41.18,47.99 270 top
D18  38.64,47.99 270 top
D19  43.72,47.99 270 top
F1  37.85,54.61 0 top
GAUGE_ON  64.77,98.79 0 top
GAUGE_S  93.98,89.9 180 top
IC2  77.72,58.26 270 top
IRLS3034-7P  7.62,53.07 90 top
IRLS3034-7P1  7.62,65.77 90 top
J1  153,33 270 top
J2  153,19 270 top
JP1  93.98,84.82 180 top
JP2  34.29,98.79 180 top
JP3  27.94,98.79 180 top
L1  32.29,40.37 180 top
LED1  27.94,72.12 90 top
LED2  71.12,70.85 0 top
LED3  35.56,72.12 90 top
OKI-78SR1-3V3  43.18,73.39 0 top
OKI-78SR-5V  54.61,73.39 0 top
Q10  111.76,28.18 90 top
Q11  111.76,41.64 90 top
Q12  59.69,92.44 90 top
Q13  53.34,92.44 90 top
Q14  46.99,92.44 90 top
Q15  40.64,92.44 90 top
R1  76.74,26.4 270 top
R2  82.31,24.59 0 top
R3  70.39,26.4 270 top
R4  75.47,22.59 0 top
R5  64.04,26.4 270 top
R6  69.12,22.59 0 top
R7  57.69,26.4 270 top
R8  62.77,22.59 0 top
R9  51.34,26.4 270 top
R10  56.17,22.59 0 top
R11  44.99,26.4 270 top
R12  50.07,22.59 0 top
R13  38.64,26.4 270 top
R14  43.72,22.59 0 top
R15  32.29,26.4 270 top
R16  37.37,22.59 0 top
R17  136.88,76.47 0 top
R18  140.3,87.37 0 top
R19  136.7,82.57 180 top
R20  31.75,72.12 270 top
R21  133.45,87.4 180 top
R24  22.86,59.42 0 top
R37  32.29,44.18 180 top
R38  27.94,79.74 0 top
R39  34.29,79.74 0 top
R40  24.64,72.12 270 top
R41  24.13,53.07 180 top
R42  30.48,53.07 180 top
R47  71.12,64.5 270 top
R48  73.66,64.5 270 top
R49  76.2,64.5 270 top
R50  78.74,64.5 270 top
R51  81.28,64.5 270 top
R52  83.82,64.5 270 top
R53  86.36,64.5 270 top
R54  88.9,64.5 270 top
R55  91.44,64.5 270 top
R56  93.98,64.5 270 top
R57  64.77,93.71 0 top
R58  93.98,96.25 270 top
R59  91.44,96.25 270 top
R60  88.9,96.25 270 top
R61  86.36,96.25 270 top
R62  83.82,96.25 270 top
R63  81.28,96.25 270 top
R64  78.74,96.25 270 top
R65  76.2,96.25 270 top
R66  73.66,96.25 270 top
R67  71.12,96.25 270 top
R72  138.43,40.37 270 top
R73  138.43,34.02 270 top
S1  40.64,64.5 90 top
S2  66.04,74.66 90 top
U$1  12.7,36.56 270 top
U$2  99.06,23.86 0 top
U$3  58.96,45.45 270 top
U$4  99.06,37.83 0 top
U$8  32,89.14 90 top
U$13  160.02,100.06 180 top
U$14  125.83,-33.4 0 top  (outside the outline)
U$15  128.27,36.56 270 top
V_ARRAY  14.43,13.43 0 top
V_OUT  11.43,84.82 0 top
V_OUT1  82.82,11.43 0 top
X1  59.69,97.79 0 top
X2  53.34,97.79 0 top
X3  46.99,97.79 0 top
X4  40.64,97.79 0 top

### Tracks (layer width: path | path; a pad name or v marks a point on that pad's centre or on a via)
5V  (2 unrouted)
  Top 0.406: 78,63.08 R49.2 R48.2 R47.2 94.92,63.08 95,63 100,68 100,96.7 99.1,97.6 97.84,97.6 C21.1 94,97.65 R58.1 R59.1 R60.1 R61.1 R62.1 R63.1 R64.1 R65.1 R66.1 R67.1 70.79,98 70,98 69,97 69,90 63,84 | 78,63.08 R50.2 R51.2 R52.2 R53.2 R54.2 R55.2 R56.2 93.98,63.02 99,58 99,43 94,38 93,38 93.06,37.94 U$4.P$2 U$2.P$2 | X4.2 44.12,100 46,100 48.21,97.79 X3.2 50.47,100 52,100 54.21,97.79 X2.2 56.82,100 59,100 60.96,98.04 X1.2 63,95.75 63,94 63.29,93.71 R57.1 63,93.36 63,84 | 63,84 52.39,73.39 | 52.39,73.39 OKI-78SR-5V.3 | 52.39,73.39 59.88,67.9 C23.+ | IC2.P$1 77.72,62.8 78,63.08
+3V3  (9 unrouted)
BMS_CSBI  (via drill 0.6)  (1 unrouted)
  Top 0.406: U$3.44 70.3,50.7 v74,47 | v141.75,85 141.72,86.72 R18.2
  Bottom 0.406: v74,47 76,45 108,45 132,69 132,84 133,85 v141.75,85
BMS_MISO  (via drill 0.6)
  Top 0.406: U$3.43 69.4,50.2 75.6,44 v77,44 | v136,72 136.03,72.03 R17.1 136.03,75.97 137,75 148,75 149,76 151.06,76 U$13.6.5
  Bottom 0.406: v77,44 109,44 136,71 v136,72
BMS_MOSI  (via drill 0.6)  (1 unrouted)
  Top 0.406: U$3.42 69,49.7 75.7,43 v79,43 | v134,67 134,81.29 R19.2
  Bottom 0.406: v79,43 110,43 v134,67
BMS_SCLK  (via drill 0.6)  (1 unrouted)
  Top 0.406: U$3.41 67.8,49.2 v70,47 | v132,63 132.03,63.03 R21.2
  Bottom 0.406: v70,47 75,42 111,42 v132,63
BMS_VREG  (via drill 0.6)  (1 unrouted)
  Top 0.406: 62.31,48.65 65,48.65 | 65,48.65 67.5,48.65 68,48.15 v68,46 | v139,79 138.12,80.88 R19.1 138.88,83.33 R18.1 138.85,87.4 R21.1 | U$3.34 64.65,45.7 65,46.05 65,48.65
  Bottom 0.406: v68,46 73,41 112,41 139,68 v139,79
BUZZ_1
  Top 0.406: Q11.1 112.99,40.99 116,44 116,55.18 U$13.5.6
BUZZ_2  (via drill 0.6)
  Top 0.406: Q10.1 113.53,27.53 117,31 v117,32 | v117,36 117,56 110,63 107,63 106.68,62.68 U$13.5.7
  Bottom 0.406: v117,32 v117,36
CELL_1
  Top 0.406: CELL-MEAS.8 CELL-IN.8 64.04,17.51 65.31,18.78 72.93,18.78 76.32,22.17 R4.2 76.74,23.01 R1.2
CELL_1_BAL  (via drill 0.6)
  Top 0.406: R2.1 v79.28,24.59 | v77.74,39.37 74.41,42.7 U$3.28
  Bottom 0.406: v79.28,24.59 79.28,37.83 v77.74,39.37
CELL_1_FILTER
  Top 0.406: R1.1 76.86,27.95 C1.1 76.86,35.05 D3.A | D3.A D1.C | D3.A 76.62,38.2 72.62,42.2 U$3.27
CELL_2
  Top 0.406: CELL-MEAS.7 CELL-IN.7 61.5,17.51 64.04,20.05 67.85,20.05 69.97,22.17 R6.2 70.39,23.01 R3.2
CELL_2_BAL  (via drill 0.6)
  Top 0.406: R4.1 v72.93,22.59 | v72.69,39.47 70.47,41.69 U$3.26
  Bottom 0.406: v72.93,22.59 72.93,39.1 v72.69,39.47
CELL_2_FILTER
  Top 0.406: R3.1 70.51,27.95 C2.1 70.27,31.47 D5.A | D5.A D3.C | U$3.25 68.29,41.2 70.39,39.1 70.39,35.41 D5.A
CELL_3
  Top 0.406: CELL-MEAS.6 CELL-IN.6 58.96,17.51 63.62,22.17 R8.2 64.04,23.01 R5.2
CELL_3_BAL  (via drill 0.6)  (1 unrouted)
  Top 0.406: R6.1 v66.58,22.59 | v66.58,37.83 66.58,38.13 64.04,40.7 62.28,40.7
  Bottom 0.406: v66.58,22.59 v66.58,37.83
CELL_3_FILTER
  Top 0.406: R5.1 64.16,27.95 C3.1 63.92,31.47 D7.A | D5.C D7.A | U$3.23 62.94,40.2 64.04,39.1 64.04,35.41 D7.A
CELL_4
  Top 0.406: CELL-MEAS.5 CELL-IN.5 56.42,20.05 57.69,21.32 57.69,22.59 | 57.69,22.59 R7.2 | R10.2 57.69,22.59
CELL_4_BAL  (via drill 0.6)
  Top 0.406: R8.1 v60.23,22.59 | v55.15,39.1 55.15,39.69 U$3.22
  Bottom 0.406: v60.23,22.59 60.23,34.02 v55.15,39.1
CELL_4_FILTER
  Top 0.406: R7.1 57.81,27.95 C4.1 57.57,31.47 D9.A | D9.A D7.C | D9.A 54.13,38.73 54.13,40.12 54.72,40.7 U$3.21
CELL_5
  Top 0.406: CELL-MEAS.4 CELL-IN.4 53.88,20.05 51.34,22.59 R12.2 51.34,23.01 R9.2
CELL_5_BAL  (via drill 0.6)
  Top 0.406: U$3.20 54.38,41.2 v52.91,39.73 | v53.88,22.59 R10.1
  Bottom 0.406: v52.91,39.73 52.91,23.55 v53.88,22.59
CELL_5_FILTER
  Top 0.406: R9.1 51.46,27.82 C5.1 51.34,31.23 51.34,35.29 D11.A | D11.A D9.C | U$3.19 53.94,41.7 51.34,39.1 51.34,35.41 D11.A
CELL_6
  Top 0.406: CELL-MEAS.3 CELL-IN.3 51.34,17.51 46.26,22.59 R14.2 44.99,23.01 R11.2
CELL_6_BAL  (via drill 0.6)  (1 unrouted)
  Top 0.406: R12.1 v47.53,22.59 | v51.34,40.37 53.17,42.2 U$3.18
  Bottom 0.406: v47.53,22.59 47.53,36.56 v51.34,40.37
CELL_6_FILTER
  Top 0.406: R11.1 45.11,27.82 C6.1 44.87,31.47 D13.A D11.C 48.8,35.41 48.8,39.1 52.4,42.7 U$3.17
CELL_7
  Top 0.406: CELL-MEAS.2 CELL-IN.2 44.99,18.78 42.45,18.78 38.64,22.59 R16.2 38.64,23.01 R13.2
CELL_7_BAL  (via drill 0.6)  (1 unrouted)
  Top 0.406: R14.1 v41.18,22.59 | v50.07,41.64 51.62,43.19 55.62,43.19
  Bottom 0.406: v41.18,22.59 41.18,32.75 v50.07,41.64
CELL_7_FILTER
  Top 0.406: R13.1 38.76,27.82 C7.1 38.52,31.47 D15.A D13.C 50.98,43.7 U$3.15
CELL_8  (19 unrouted)
  Top 0.406: CELL-MEAS.1 CELL-IN.1 43.72,17.51 34.83,17.51 32.29,20.05 R15.2
CELL_8_BAL  (via drill 0.6)  (1 unrouted)
  Top 0.406: R16.1 v34.83,22.59 | v47.53,42.91 48.8,44.18 55.64,44.18
  Bottom 0.406: v34.83,22.59 34.83,30.21 v47.53,42.91
CELL_8_FILTER
  Top 0.406: R15.1 32.41,27.95 C8.1 36.22,35.03 D15.C 45.63,44.7 52.61,44.7 | 52.61,44.7 U$3.13 | U$3.5 53.32,48.7 52.61,47.99 | 52.61,47.99 52.61,46.72 | 52.61,46.72 52.61,44.7 | U$3.7 52.9,47.7 52.61,47.99 | U$3.9 52.63,46.7 52.61,46.72
FAN_CTL_1  (1 unrouted)
FAN_CTL_2  (1 unrouted)
FAN_CTL_3  (1 unrouted)
FAN_CTL_4  (1 unrouted)
GAUGE_D  (via drill 0.6)
  Top 0.406: JP1.7 LED2.P$17 | v70,52 77.63,52 IC2.P$6
  Bottom 0.406: LED2.P$17 78.74,75.74 78,75 71,75 67,71 67,55 v70,52
GAUGE_ON  (via drill 0.6)  (2 unrouted)
  Top 0.406: R57.2 67.31,94.83 GAUGE_ON.2 | S2.3 67.94,61.05 70,59 v75.7,59 | v75.7,46.9 77.65,46.9 IC2.P$10
  Bottom 0.406: v75.7,59 v75.7,46.9
GND  (via drill 0.6)  (4 unrouted)
  Top 0.406: U$3.35 63.7,46.2 64,46.5 v64,47 64,48 63.25,48 | 63.25,48 62.26,48 U$3.38 63.25,47.7 63.25,48 | U$3.29 63.4,43.2
  pour Top: -7.62,107.68 170.18,107.68 172.45,-9.35 -5.35,-9.35 -8.62,108.41
  pour Bottom: -14,109 179,110 181,-19 -10,-19
LED_CLR  (1 unrouted)
LED_RCK  (1 unrouted)
LED_SER_IN  (1 unrouted)
LED_SRCK  (1 unrouted)
LOGIC_POWER  (4 unrouted)
N$1
  Top 0.406: U$8.5 25.4,95.05 JP3.2
N$2  (2 unrouted)
N$3  (12 unrouted)
N$4
  Top 0.406: R20.1 35.48,73.54 LED3.C
N$6
  Top 0.406: JP2.2 JP3.1
N$26
  Top 0.406: D19.C D17.C D18.C 32.59,49.56 31.02,47.99 31.02,44.33 R37.2 30.87,40.55 L1.2
N$31
  Top 0.406: U$3.4 48.74,49.2 43.72,44.18 36.22,44.18 C13.1 35.98,44.18 R37.1
N$32  (via drill 0.6)
  Top 0.406: JP1.10 LED2.P$20 | v64.05,55.7 77.7,55.7 IC2.P$3
  Bottom 0.406: LED2.P$20 71.12,78.12 64,71 64,55.75 v64.05,55.7
N$34  (3 unrouted)
N$35  (2 unrouted)
  Top 0.406: R73.2 139.05,32
N$36
  Top 0.406: R40.1 27.86,73.54 LED1.C
N$41  (22 unrouted)
  Top 0.406: C14.1 27.25,87.23 | 27.25,87.23 U$8.8 | U$8.6 29.38,89.8 27.33,89.8 27.25,89.72 27.25,87.23
N$43  (via drill 0.6)
  Top 0.406: JP1.9 LED2.P$19 | v65.6,54.3 77.57,54.3 IC2.P$4
  Bottom 0.406: LED2.P$19 73.66,77.66 73,77 71,77 65,71 65,54.9 v65.6,54.3
N$44  (via drill 0.6)
  Top 0.406: JP1.8 LED2.P$18 | v67.9,53.2 77.59,53.2 IC2.P$5
  Bottom 0.406: LED2.P$18 76.2,77.2 75,76 71,76 66,71 66,55 v67.9,53.2
N$45  (2 unrouted)
N$46  (via drill 0.6)
  Top 0.406: JP1.6 LED2.P$16 | v72,51 72.4,50.6 77.68,50.6 IC2.P$7
  Bottom 0.406: LED2.P$16 81.28,75.28 80,74 71,74 68,71 68,55 v72,51
N$47  (via drill 0.6)
  Top 0.406: JP1.5 LED2.P$15 | v74.7,49.3 76.65,49.3 IC2.P$8
  Bottom 0.406: LED2.P$15 83.82,74.82 82,73 71,73 69,71 69,55 v74.7,49.3
N$48  (via drill 0.6)
  Top 0.406: JP1.4 LED2.P$14 | v91.1,49.4 87.15,49.4 IC2.P$13
  Bottom 0.406: LED2.P$14 86.36,76.64 88,75 93,75 96,72 96,54.3 v91.1,49.4
N$49  (via drill 0.6)
  Top 0.406: JP1.3 LED2.P$13 | 87.21,50.55 IC2.P$14 93.56,50.64 v93.6,50.6
  Bottom 0.406: LED2.P$13 91.25,76 93,76 97,72 97,54 v93.6,50.6
N$50  (via drill 0.6)
  Top 0.406: JP1.2 LED2.P$12 | v95.95,51.9 IC2.P$15
  Bottom 0.406: LED2.P$12 91.65,78.35 98,72 98,53.95 v95.95,51.9
N$51  (via drill 0.6)  (1 unrouted)
  Top 0.406: JP1.1 93.98,78.47 | v98,53 97.82,53.18 IC2.P$16
  Bottom 0.406: LED2.P$11 99,73.33 99,54 v98,53
N$52
  Top 0.406: LED2.P$1 R47.1
N$53
  Top 0.406: R48.1 LED2.P$2
N$54
  Top 0.406: R49.1 LED2.P$3
N$55
  Top 0.406: R50.1 LED2.P$4
N$56
  Top 0.406: LED2.P$5 R51.1
N$57
  Top 0.406: LED2.P$6 R52.1
N$58
  Top 0.406: LED2.P$7 R53.1
N$59
  Top 0.406: LED2.P$8 R54.1
N$60
  Top 0.406: LED2.P$9 R55.1
N$61
  Top 0.406: LED2.P$10 R56.1
N$62  (2 unrouted)
N$63
  Top 0.406: U$4.P$1 108.87,41.64 Q11.3
N$64
  Top 0.406: U$2.P$1 109.38,28.18 Q10.3
N$66
  Top 0.406: Q12.3 58.42,92.78 X1.1
N$67  (2 unrouted)
  Top 0.406: 138.77,41.77 R72.1
N$70
  Top 0.406: Q13.3 52.07,92.78 X2.1
N$71
  Top 0.406: Q14.3 45.72,92.78 X3.1
N$72
  Top 0.406: Q15.3 39.37,92.78 X4.1
N$75
  Top 0.406: GAUGE_S.1 R58.2
N$76
  Top 0.406: GAUGE_S.2 R59.2
N$77
  Top 0.406: GAUGE_S.3 R60.2
N$78
  Top 0.406: GAUGE_S.4 R61.2
N$79
  Top 0.406: GAUGE_S.5 R62.2
N$80
  Top 0.406: R63.2 GAUGE_S.6
N$81
  Top 0.406: R64.2 GAUGE_S.7
N$82
  Top 0.406: R65.2 GAUGE_S.8
N$83
  Top 0.406: R66.2 GAUGE_S.9
N$84
  Top 0.406: R67.2 GAUGE_S.10
PACK_GATE  (1 unrouted)
PACK_I_MEAS  (1 unrouted)
SER_IN  (via drill 0.6)
  Top 0.406: U$15.RO v124,37.2 | v124,49 124,89.44 U$13.9.6
  Bottom 0.406: v124,37.2 v124,49
SER_OUT  (via drill 0.6)
  Top 0.406: U$15.DI 123.08,35.92 v123.2,35.95 | U$13.9.7 125.48,96.25 125.43,96.2 123.6,96.2 123.15,95.75 123.15,46 v123.2,46
  Bottom 0.406: v123.2,35.95 v123.2,46
TEMP_1  (1 unrouted)
TEMP_2  (1 unrouted)
V_CHECK_ARRAY  (1 unrouted)
  Top 0.406: R41.1 R42.2
V_CHECK_OUT  (2 unrouted)
(copper drawn outside any net)
  shapes: Top area x2